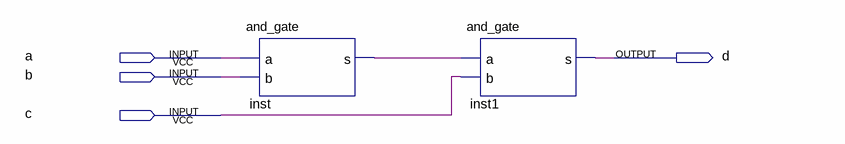
[diagram p0: schematic sheet]
// Quartus schematic top.bdf as structural Verilog: 2 symbols, 4 pins
module top (
  input  a,
  input  b,
  input  c,
  output d
);

  wire inst_s;

  and_gate inst (.a(a), .b(b), .s(inst_s));
  and_gate inst1 (.a(inst_s), .b(c), .s(d));
endmodule
